# EAGLE design lec-buzzer_alt (EAGLE 8.4.0)
REVISION: v1.1; TEAM: Electrical Training
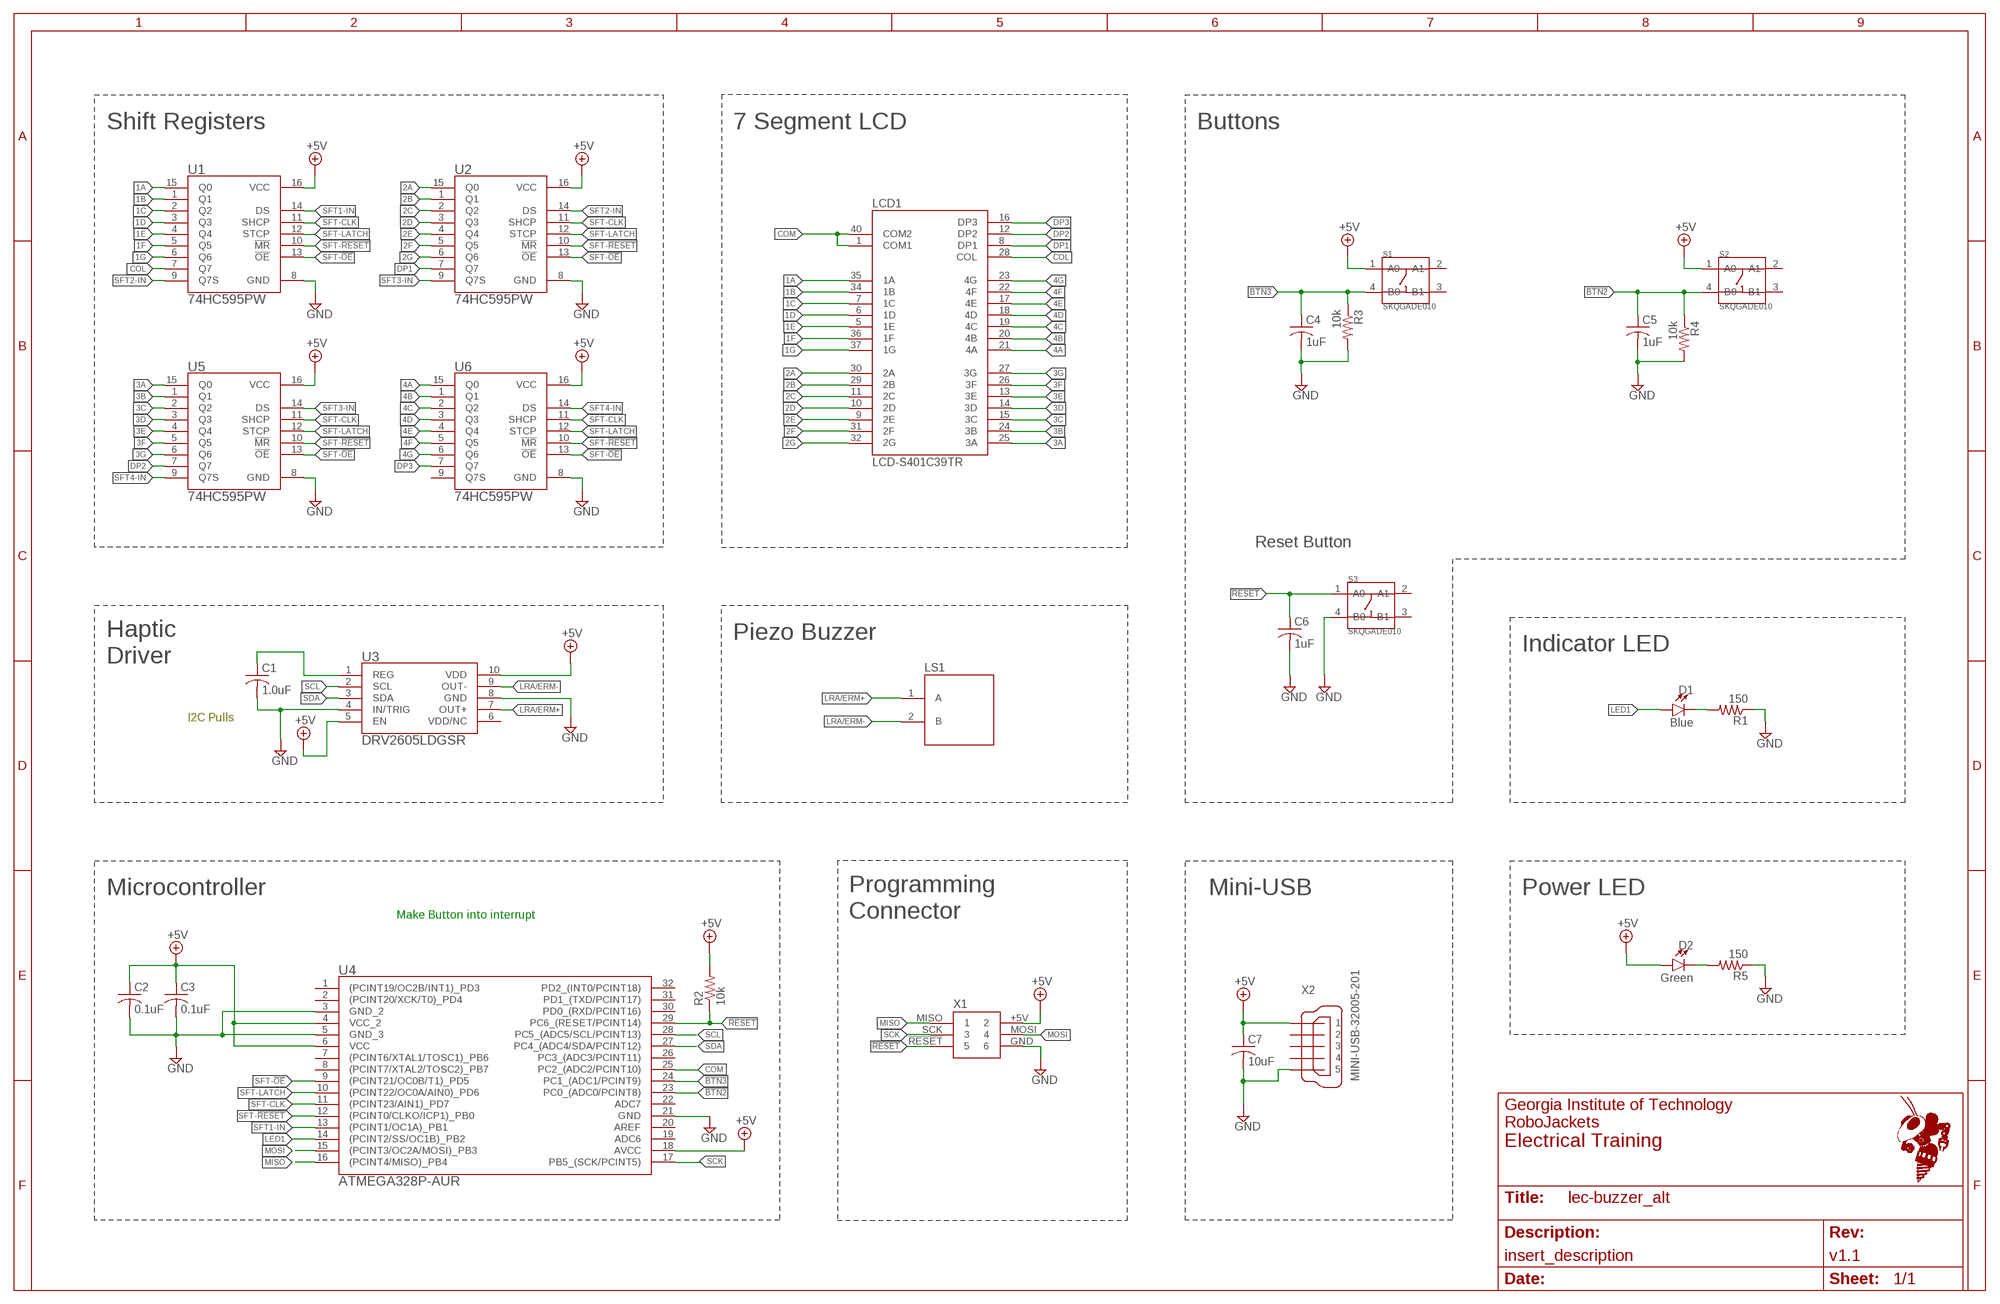
[diagram p0: schematic, sheet 1]
FRAME1 (FRAME_B_L): SCH_DESC: insert_description

## Parts
C1  1.0uF  C-USC0603  [C0603]
C2  0.1uF  C-USC0603  [C0603]
C3  0.1uF  C-USC0603  [C0603]
C4  1uF  C-USC0603  [C0603]
C5  1uF  C-USC0603  [C0603]
C6  1uF  C-USC0603  [C0603]
C7  10uF  C-USC0603  [C0603]
D1  Blue  LED-YELLOW0603  [LED-0603]
D2  Green  LED-YELLOW0603  [LED-0603]
LCD1  LCD-S401C39TR  [S401C39TR]
LS1  PS1240P02BT  [PS1240P02BT]
R1  150  R-US_R0603  [R0603]
R2  10k  R-US_R0603  [R0603]
R3  10k  R-US_R0603  [R0603]
R4  10k  R-US_R0603  [R0603]
R5  150  R-US_R0603  [R0603]
S1  SKQGADE010  SMD-SWITCH-TOP-260GF(4P-D5.2MM)  [SW4-SMD-5.2X5.2X1.5MM]
S2  SKQGADE010  SMD-SWITCH-TOP-260GF(4P-D5.2MM)  [SW4-SMD-5.2X5.2X1.5MM]
S3  SKQGADE010  SMD-SWITCH-TOP-260GF(4P-D5.2MM)  [SW4-SMD-5.2X5.2X1.5MM]
U1  74HC595PW  [SOT403-1]
U2  74HC595PW  [SOT403-1]
U3  DRV2605LDGSR  [DGS10]
U4  ATMEGA328P-AUR  [ATMEGA328P-AUR]
U5  74HC595PW  [SOT403-1]
U6  74HC595PW  [SOT403-1]
X1  2X3SHROUDED  [2X3SHROUDED]
X2  MINI-USB-32005-201  [32005-201]

## Nets
1A: LCD1.35(1A) U1.15(Q0)
1B: LCD1.34(1B) U1.1(Q1)
1C: LCD1.7(1C) U1.2(Q2)
1D: LCD1.6(1D) U1.3(Q3)
1E: LCD1.5(1E) U1.4(Q4)
1F: LCD1.36(1F) U1.5(Q5)
1G: LCD1.37(1G) U1.6(Q6)
2A: LCD1.30(2A) U2.15(Q0)
2B: LCD1.29(2B) U2.1(Q1)
2C: LCD1.11(2C) U2.2(Q2)
2D: LCD1.10(2D) U2.3(Q3)
2E: LCD1.9(2E) U2.4(Q4)
2F: LCD1.31(2F) U2.5(Q5)
2G: LCD1.32(2G) U2.6(Q6)
3A: LCD1.25(3A) U5.15(Q0)
3B: LCD1.24(3B) U5.1(Q1)
3C: LCD1.15(3C) U5.2(Q2)
3D: LCD1.14(3D) U5.3(Q3)
3E: LCD1.13(3E) U5.4(Q4)
3F: LCD1.26(3F) U5.5(Q5)
3G: LCD1.27(3G) U5.6(Q6)
4A: LCD1.21(4A) U6.15(Q0)
4B: LCD1.20(4B) U6.1(Q1)
4C: LCD1.19(4C) U6.2(Q2)
4D: LCD1.18(4D) U6.3(Q3)
4E: LCD1.17(4E) U6.4(Q4)
4F: LCD1.22(4F) U6.5(Q5)
4G: LCD1.23(4G) U6.6(Q6)
!BTN2: C5.1 R4.1 S2.4(B0) U4.23(PC0_(ADC0/PCINT8))
!BTN3: C4.1 R3.1 S1.4(B0) U4.24(PC1_(ADC1/PCINT9))
!RESET: C6.1 R2.1 S3.1(A0) U4.29(PC6_(RESET/PCINT14)) X1.!RESET
+5V: C2.1 C3.1 C7.1 D2.A R2.2 S1.1(A0) S2.1(A0) U1.16(VCC) U2.16(VCC) U3.5(EN) U3.10(VDD) U4.4(VCC_2) U4.6(VCC) U4.18(AVCC) U5.16(VCC) U6.16(VCC) X1.+5V X2.1
COL: LCD1.28(COL) U1.7(Q7)
COM: LCD1.1(COM1) LCD1.40(COM2) U4.25(PC2_(ADC2/PCINT10))
DP1: LCD1.8(DP1) U2.7(Q7)
DP2: LCD1.12(DP2) U5.7(Q7)
DP3: LCD1.16(DP3) U6.7(Q7)
GND: C1.2 C2.2 C3.2 C4.2 C5.2 C6.2 C7.2 R1.1 R3.2 R4.2 R5.1 S3.4(B0) U1.8(GND) U2.8(GND) U3.4(IN/TRIG) U3.8(GND) U4.3(GND_2) U4.5(GND_3) U4.21(GND) U5.8(GND) U6.8(GND) X1.GND X2.5
LED1: D1.A U4.14((PCINT2/SS/OC1B)_PB2)
LRA/ERM+: LS1.1(A) U3.7(OUT+)
LRA/ERM-: LS1.2(B) U3.9(OUT-)
MISO: U4.16((PCINT4/MISO)_PB4) X1.MISO
MOSI: U4.15((PCINT3/OC2A/MOSI)_PB3) X1.MOSI
N$1: D1.C R1.2
N$2: D2.C R5.2
N$3: C1.1 U3.1(REG)
SCK: U4.17(PB5_(SCK/PCINT5)) X1.SCK
SCL: U3.2(SCL) U4.28(PC5_(ADC5/SCL/PCINT13))
SDA: U3.3(SDA) U4.27(PC4_(ADC4/SDA/PCINT12))
SFT1-IN: U1.14(DS) U4.13((PCINT1/OC1A)_PB1)
SFT2-IN: U1.9(Q7S) U2.14(DS)
SFT3-IN: U2.9(Q7S) U5.14(DS)
SFT4-IN: U5.9(Q7S) U6.14(DS)
SFT-!OE: U1.13(!OE) U2.13(!OE) U4.9((PCINT21/OC0B/T1)_PD5) U5.13(!OE) U6.13(!OE)
SFT-!RESET: U1.10(!MR) U2.10(!MR) U4.12((PCINT0/CLKO/ICP1)_PB0) U5.10(!MR) U6.10(!MR)
SFT-CLK: U1.11(SHCP) U2.11(SHCP) U4.11((PCINT23/AIN1)_PD7) U5.11(SHCP) U6.11(SHCP)
SFT-LATCH: U1.12(STCP) U2.12(STCP) U4.10((PCINT22/OC0A/AIN0)_PD6) U5.12(STCP) U6.12(STCP)
Unconnected: S1.2(A1) S1.3(B1) S2.2(A1) S2.3(B1) S3.2(A1) S3.3(B1) U3.6(VDD/NC) U4.1((PCINT19/OC2B/INT1)_PD3) U4.2((PCINT20/XCK/T0)_PD4) U4.7((PCINT6/XTAL1/TOSC1)_PB6) U4.8((PCINT7/XTAL2/TOSC2)_PB7) U4.19(ADC6) U4.20(AREF) U4.22(ADC7) U4.26(PC3_(ADC3/PCINT11)) U4.30(PD0_(RXD/PCINT16)) U4.31(PD1_(TXD/PCINT17)) U4.32(PD2_(INT0/PCINT18)) U6.9(Q7S) X2.2 X2.3 X2.4

## Notes on the sheet
- Shift Registers | 7 Segment LCD | Buttons
- Reset Button
- Piezo Buzzer
- Indicator LED
- Haptic
  Driver
- I2C Pulls
- Microcontroller | Mini-USB | Power LED
- Make Button into interrupt
- Programming
  Connector

## Library data of the parts
C1-C3 C7 = rcl:C-US: CAPACITOR, American symbol
C4-C6 = resistor:C-US: CAPACITOR, American symbol
D1 D2 = SparkFun-LED:LED-YELLOW: Yellow SMD LED Used in manufacturing several products at SparkFun. Packages: 0603 - SMD 0603 package[Product Link] <http://www.kingbrightusa.com/product.asp?catalog_name=LED&product_id=APT1608SYCK> 0603 -SMART - SMART SMD 0603 package (more efficient/more expensive) [Product Link] <http://www.osram-os.com/osram_os/en/products/product-catalog/led-light-emitting-diodes/smartled-0603/ly-l29k/index.jsp> LilyPad - SMD1206 package[Product Datasheet] <https://www.sparkfun.com/datasheets/DevTools/LilyPad/Q150YUS4.pdf> SparkFun Products: Blynk Board <https://www.sparkfun.com/products/13794> IOIO-OTG <https://www.sparkfun.com/products/13613> XBee Explorer Serial <https://www.sparkfun.com/products/13225>; PROD_ID: DIO-09003; VALUE: Yellow
LCD1 = lcd-buzzer:LCD-S401C39TR
LS1 = lcd-buzzer:PS1240P02BT
R1 R3-R5 = resistor:R-US_: RESISTOR, American symbol
R2 = rcl:R-US_: RESISTOR, American symbol
S1-S3 = rgb-led:SMD-SWITCH-TOP-260GF(4P-D5.2MM): 311020017; MPN: SKQGADE010
U1 U2 U5 U6 = lcd-buzzer:74HC595PW
U3 = lcd-buzzer:DRV2605LDGSR; MANUFACTURER_PART_NUMBER: DRV2605LDGSR; VENDOR: Texas Instruments
U4 = lcd-buzzer:ATMEGA328P-*
X1 = lcd-buzzer:2X3SHROUDED
X2 = con-cypressindustries:MINI-USB-: MINI USB-B Conector Source: www.cypressindustries.com; OC_FARNELL: unknown; OC_NEWARK: unknown

## Board
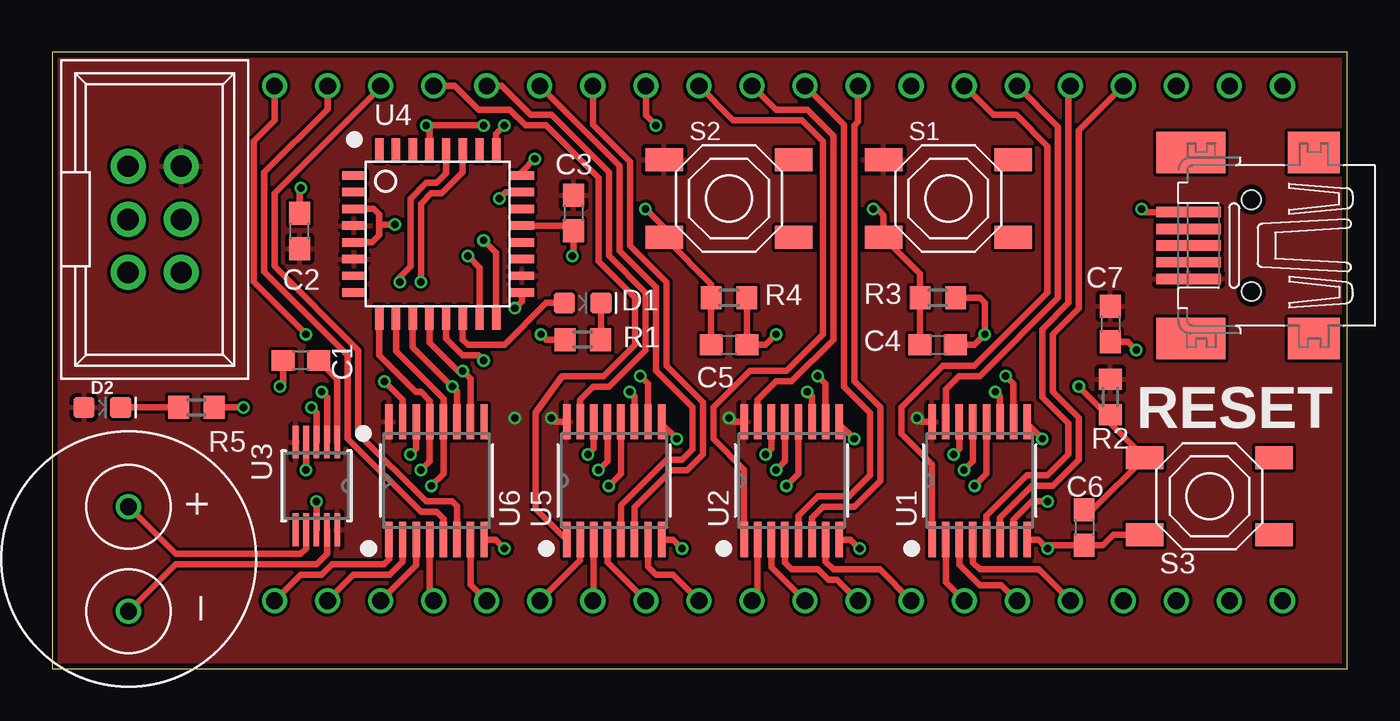
[diagram p1: board, top side]
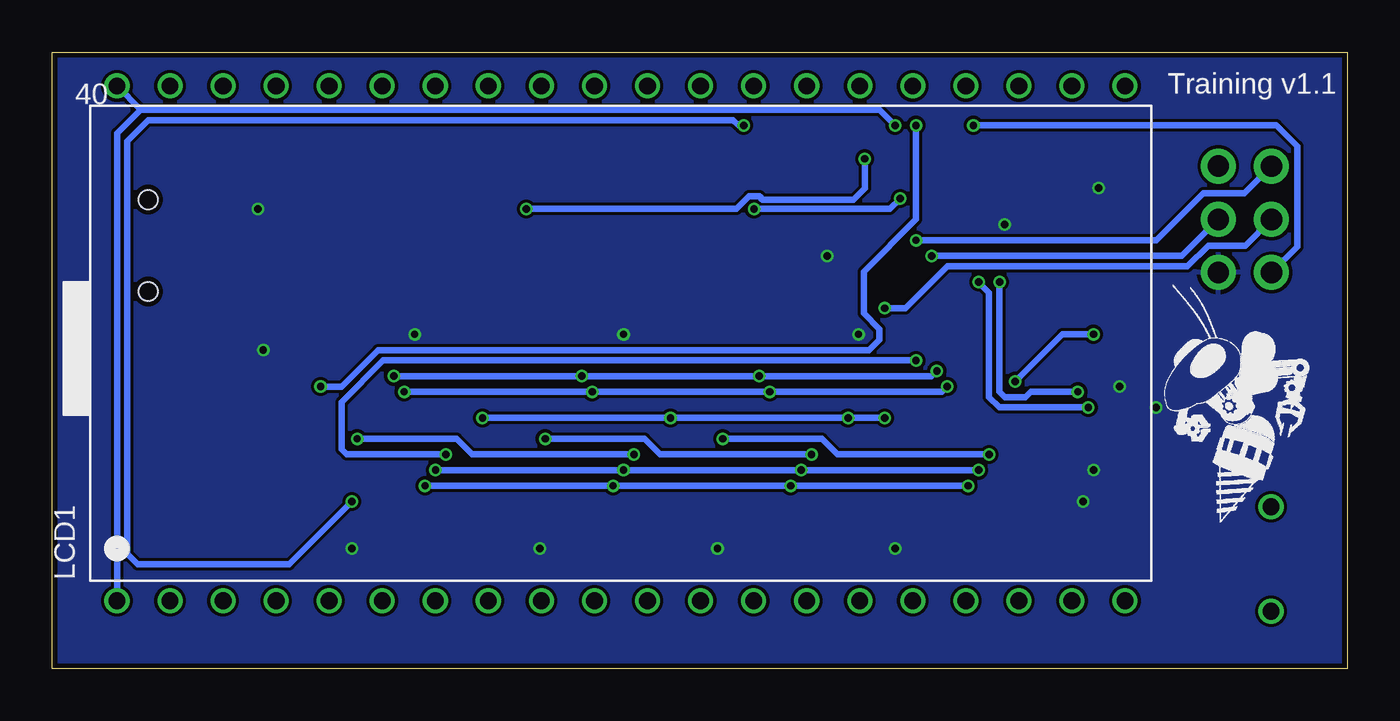
[diagram p2: board, bottom side, seen from below]

Size 62 x 29.5 mm. Coordinates in mm from the lower left corner, seen from the top.
Outline: 0,0 62,0 62,29.5 0,29.5 0,0
Copper layers (1*16): Top 0.018mm / dielectric 1.55mm / Bottom 0.018mm
Design rules "eC_2Layer_PClass6_BaseCopperO18_eCDefault *": minimum track width 0.15mm, minimum drill 0.35mm, track to track 0.15mm, track to pad 0.15mm, pad to pad 0.15mm, via to via 0.15mm, smd to smd 0mil, copper to edge 0.25mm, drill to drill 0.35mm, minimum pad ring 0.175mm, minimum via ring 0.125mm, stop-mask expansion 0mil, vias tented up to drill 0.45mm, thermal gap 0.2mm

### Footprints (pad centres in the part's own frame; a part is rotated, then mirrored left to right if it is on the bottom)
C0603 = smd 1.1 x 1: 1 -0.85,0; 2 0.85,0
LED-0603 = smd 1 x 1: A -0.877,0; C 0.877,0
S401C39TR = drill 0.8: 1 -24,-12.5; 2 -21.46,-12.5; 3 -18.92,-12.5; 4 -16.38,-12.5; 5 -13.84,-12.5; 6 -11.3,-12.5; 7 -8.76,-12.5; 8 -6.22,-12.5; 9 -3.68,-12.5; 10 -1.14,-12.5; 11 1.4,-12.5; 12 3.94,-12.5; 13 6.48,-12.5; 14 9.02,-12.5; 15 11.56,-12.5; 16 14.1,-12.5; 17 16.64,-12.5; 18 19.18,-12.5; 19 21.72,-12.5; 20 24.26,-12.5; 21 24.26,12.138; 22 21.72,12.138; 23 19.18,12.138; 24 16.64,12.138; 25 14.1,12.138; 26 11.56,12.138; 27 9.02,12.138; 28 6.48,12.138; 29 3.94,12.138; 30 1.4,12.138; 31 -1.14,12.138; 32 -3.68,12.138; 33 -6.22,12.138; 34 -8.76,12.138; 35 -11.3,12.138; 36 -13.84,12.138; 37 -16.38,12.138; 38 -18.92,12.138; 39 -21.46,12.138; 40 -24,12.138
PS1240P02BT = drill 0.8: 1 -2.5,0; 2 2.5,0
R0603 = smd 1 x 1.1: 1 -0.85,0; 2 0.85,0
SW4-SMD-5.2X5.2X1.5MM = smd 1.8 x 1.1: 1 -3.1,1.85; 2 3.1,1.85; 3 3.1,-1.85; 4 -3.1,-1.85
SOT403-1 = smd 1.676 x 0.356: 1 -2.819,2.275; 2 -2.819,1.625; 3 -2.819,0.975; 4 -2.819,0.325; 5 -2.819,-0.325; 6 -2.819,-0.975; 7 -2.819,-1.625; 8 -2.819,-2.275; 9 2.819,-2.275; 10 2.819,-1.625; 11 2.819,-0.975; 12 2.819,-0.325; 13 2.819,0.325; 14 2.819,0.975; 15 2.819,1.625; 16 2.819,2.275
DGS10 = smd 1.575 x 0.279: 1 -2.095,1; 2 -2.095,0.5; 3 -2.095,0; 4 -2.095,-0.5; 5 -2.095,-1; 6 2.095,-1; 7 2.095,-0.5; 8 2.095,0; 9 2.095,0.5; 10 2.095,1
ATMEGA328P-AUR = smd 1.15 x 0.4: 1 -3.946,2.603; 2 -3.955,1.803; 3 -3.955,1.003; 4 -3.955,0.203; 5 -3.955,-0.597; 6 -3.955,-1.397; 7 -3.955,-2.197; 8 -3.955,-2.997; 17 4.085,-2.997; 18 4.085,-2.197; 19 4.085,-1.397; 20 4.085,-0.597; 21 4.085,0.203; 22 4.085,1.003; 23 4.085,1.803; 24 4.085,2.603 | smd 0.4 x 1.15: 9 -2.743,-4.21; 10 -1.943,-4.21; 11 -1.143,-4.207; 12 -0.343,-4.21; 13 0.457,-4.21; 14 1.257,-4.207; 15 2.057,-4.207; 16 2.857,-4.207; 25 2.857,3.813; 26 2.057,3.813; 27 1.257,3.813; 28 0.457,3.811; 29 -0.343,3.811; 30 -1.143,3.813; 31 -1.943,3.811; 32 -2.743,3.811
2X3SHROUDED = drill 1.02 pad 1.676: !RESET -2.54,1.27; +5V 2.554,-1.27; GND -2.54,-1.27; MISO 2.54,1.27; MOSI 0,-1.27; SCK 0,1.27
32005-201 = smd 3.1 x 0.5: 1 3,1.6; 2 3,0.8; 3 3,0; 4 3,-0.8; 5 3,-1.6 | smd 2.5 x 2: M1 -3,-4.45; M2 -3,4.45 | smd 3.3 x 2: M3 2.9,4.45; M4 2.9,-4.45 | hole 0.9: 0,2.2; 0,-2.2

### Placement (x,y rotation side)
C1  11.9,14.75 180 top
C2  11.85,20.94 90 top
C3  24.95,21.81 270 top
C4  42.4,15.5 0 top
C5  32.4,15.5 0 top
C6  49.4,6.75 270 top
C7  50.65,16.5 270 top
D1  25.4,17.5 0 top
D2  2.4,12.5 0 top
LCD1  34.9,15.75 0 bottom
LS1  3.65,5.25 270 top
R1  25.4,15.75 0 top
R2  50.65,13 90 top
R3  42.4,17.75 0 top
R4  32.4,17.75 0 top
R5  6.9,12.5 180 top
S1  42.9,22.5 0 top
S2  32.4,22.5 0 top
S3  55.4,8.25 0 top
U1  44.4,9 90 top
U2  35.4,9 90 top
U3  12.65,8.75 270 top
U4  18.4,21 0 top
U5  26.9,9 90 top
U6  18.4,9 90 top
U$1  [ROBOBUZZ_0.6X]  6.1,7 0 bottom
X1  4.9,21.5 90 top
X2  57.4,20.25 180 top

### Tracks (layer width: path | path; a pad name or v marks a point on that pad's centre or on a via)
1A
  Top 0.3: U1.15 42.77,13.38 43.4,14 44.4,14 48.15,17.75 48.15,25.94 LCD1.35
1B
  Top 0.3: U1.1 42.12,9.78 40.65,11.25 40.65,12.5 42.65,14.5 44.15,14.5 47.65,18 47.65,25 46.15,26.5 45.05,26.5 LCD1.34
1C
  Top 0.3: U1.2 42.77,4.13 LCD1.7
1D
  Top 0.3: U1.3 43.42,4.97 44.4,4 45.45,4 LCD1.6
1E
  Top 0.3: U1.4 44.07,5.08 44.4,4.75 47.24,4.75 LCD1.5
1F
  Top 0.3: U1.5 44.73,7.33 46.65,9.25 47.65,9.25 48.65,10.25 48.65,11.75 47.4,13 47.4,16.25 48.65,17.5 48.65,27.8 LCD1.36
1G
  Top 0.3: U1.6 45.38,7.22 46.9,8.75 47.9,8.75 49.15,10 49.15,12 47.9,13.25 47.9,16 49.15,17.25 49.15,25.76 LCD1.37
2A
  Top 0.3: U2.15 33.77,12.88 34.65,13.75 35.4,13.75 37.4,15.75 37.4,25.5 36.15,26.75 34.64,26.75 LCD1.30
2B
  Top 0.3: U2.1 33.12,9.53 31.65,11 31.65,12.5 33.4,14.25 35.15,14.25 36.9,16 36.9,25.25 35.9,26.25 32.6,26.25 LCD1.29
2C
  Top 0.3: U2.2 33.77,3.52 LCD1.11
2D
  Top 0.3: U2.3 34.42,4.87 LCD1.10
2E
  Top 0.3: U2.4 35.07,5.08 35.4,4.75 36.65,4.75 37.15,4.25 37.58,4.25 LCD1.9
2F
  Top 0.3: U2.5 35.73,7.33 36.65,8.25 38.15,8.25 39.15,9.25 39.15,12.25 37.9,13.5 37.9,26.03 LCD1.31
2G
  Top 0.3: LCD1.32 38.58,26.18 38.4,26 38.4,13.75 39.65,12.5 39.65,9 38.4,7.75 36.9,7.75 36.38,7.22 U2.6
3A
  Top 0.3: LCD1.25 21.51,27.89 22.9,26.5 23.9,26.5 26.65,23.75 26.65,19.75 28.4,18 28.4,15.25 26.65,13.5 25.9,13.5 25.27,12.88 U5.15
3B
  Top 0.3: LCD1.24 19.26,27.89 20.4,26.75 21.9,26.75 22.65,26 23.65,26 26.15,23.5 26.15,19.5 27.9,17.75 27.9,15.5 26.4,14 24.4,14 23.15,12.25 23.15,7.66 U5.1
3C
  Top 0.3: U5.2 25.27,5.18 LCD1.15
3D
  Top 0.3: U5.3 25.92,3.29 LCD1.14
3E
  Top 0.3: U5.4 26.57,5.09 LCD1.13
3F
  Top 0.3: U5.5 27.22,7.83 29.4,10 30.15,10 30.65,10.5 30.65,12.5 28.9,14.25 28.9,18.25 27.15,20 27.15,24.08 LCD1.26
3G
  Top 0.3: LCD1.27 25.88,26.02 27.65,24.25 27.65,20.25 29.4,18.5 29.4,14.5 31.15,12.75 31.15,10.25 30.4,9.5 29.65,9.5 27.88,7.72 U5.6
4A  (via drill 0.35)
  Top 0.3: U6.15 16.77,12.88 v15.9,13.75 | v12.15,16 9.64,18.51 9.65,25.25 10.64,26.24 LCD1.21
  Bottom 0.3: v15.9,13.75 13.65,16 v12.15,16
4B
  Top 0.3: U6.1 16.12,5.22 15.9,5 13.4,5 12.9,4.5 11.89,4.5 LCD1.20
4C
  Top 0.3: LCD1.19 13.18,3.28 14.4,4.5 16.15,4.5 16.77,5.12 U6.2
4D
  Top 0.3: U6.3 17.42,4.96 LCD1.18
4E
  Top 0.3: U6.4 18.07,3.44 LCD1.17
4F
  Top 0.3: U6.5 18.72,7.17 18.4,7.5 17.65,7.5 14.15,11 14.15,15 10.15,19 10.15,23.75 13.18,26.78 LCD1.22
4G
  Top 0.3: U6.6 19.38,7.78 19.15,8 17.9,8 14.65,11.25 14.65,15.25 10.65,19.25 10.65,22.75 15.72,27.82 LCD1.23
!BTN2  (via drill 0.35)
  Top 0.3: C5.1 R4.1 31.55,18.4 29.42,20.52 | 29.42,20.52 S2.4 | U4.23 21.7,22.8 v21.4,22.5 | v28.4,22 29.42,20.98 29.42,20.52
  Bottom 0.3: v21.4,22.5 21.9,22 v28.4,22
!BTN3  (via drill 0.35)
  Top 0.3: C4.1 R3.1 41.55,18.9 S1.4 39.8,21.7 39.5,22 v39.3,22 | U4.24 22.48,23.79 v23.1,24.4
  Bottom 0.3: v23.1,24.4 23.1,23 23.65,22.45 28,22.45 28.15,22.6 28.65,22.6 29.25,22 v39.3,22
!RESET  (via drill 0.35)
  Top 0.3: C6.1 49.8,7.6 S3.1 50.65,11.75 R2.1 50.5,12.15 v49.15,13.5 | U4.29 18.06,25.84 v17.9,26 v20.65,26
  Bottom 0.3: v17.9,26 3.4,26 2.4,25 2.4,20.19 X1.!RESET | v49.15,13.5 48.15,13.5 46.4,15.25 22.9,15.25 22.4,15.75 22.4,16.25 23.15,17 23.15,19 20.65,21.5 v20.65,26
+5V  (via drill 0.35)
  Top 0.3: U1.16 41.58,11.82 v41.4,12 | U2.16 32.58,11.82 v32.4,12 | U5.16 24.08,11.82 v23.9,12
  Bottom 0.3: v41.4,12 v32.4,12 v23.9,12 v22.15,12
  pour Top: 0.13,29.43 61.92,29.43 61.92,-0.01 0.13,-0.01
COL  (via drill 0.35)
  Top 0.3: LCD1.28 28.42,26.48 v28.9,26 | U1.7 46.02,7.12 46.9,8 v47.65,8
  Bottom 0.3: v28.9,26 29.15,26 29.4,26.25 57.4,26.25 58.4,25.25 58.4,5.5 57.9,5 50.65,5 v47.65,8
COM  (via drill 0.35)
  Top 0.3: U4.25 21.26,25.61 v21.65,26
  Bottom 0.3: 57.76,26.75 LCD1.40 | LCD1.1 58.9,25.61 57.76,26.75 | v21.65,26 22.4,26.75 57.76,26.75
DP1
  Top 0.3: U2.7 37.02,5.12 37.4,4.75 39.62,4.75 LCD1.8
DP2
  Top 0.3: U5.7 28.52,4.88 28.9,4.5 29.71,4.5 LCD1.12
DP3
  Top 0.3: U6.7 20.02,4.03 LCD1.16
GND  (via drill 0.35)
  Top 0.3: U4.5 15.3,20.4 15.65,20.75 15.65,21.25 | U4.3 15.4,22 15.65,21.75 15.65,21.25 | v16.4,21.25 15.65,21.25 | U6.8 21.22,6.18 v21.65,5.75 | U5.8 29.72,6.18 v30.15,5.75 | U2.8 38.22,6.18 v38.65,5.75 | U1.8 47.22,6.18 v47.65,5.75 47.8,5.9 C6.2 50.3,5.9 50.8,6.4 S3.4 | R4.2 C5.2 34.15,15.5 v34.65,16 | C4.2 44.15,15.5 v44.65,16 44.65,17.5 44.4,17.75 R3.2 | X2.5 52.3,21.85 v52.15,22 | v12.15,9.5 U3.4 | C1.2 11.05,13.65 v10.9,13.5 | R5.1 v9.15,12.5 | C2.2 11.85,22.95 v11.9,23 | C7.2 51.5,15.65 v51.9,15.25 | U4.21 24.71,21.2 C3.2 24.95,19.8 v24.9,19.75 | U3.8 v12.65,8 | R1.1 23.65,15.75 v23.4,16
  pour Bottom: 0.13,29.43 61.92,29.43 61.92,-0.01 0.13,-0.01
LED1
  Top 0.3: U4.14 19.66,15.74 19.9,15.5 21.65,15.5 23.65,17.5 D1.A
LRA/ERM+
  Top 0.3: U3.7 12.15,5.75 11.9,5.5 5.9,5.5 LS1.1
LRA/ERM-
  Top 0.3: U3.9 13.15,5.5 12.65,5 5.9,5 LS1.2
MISO  (via drill 0.35)
  Top 0.3: U4.16 21.26,19.89 v20.65,20.5
  Bottom 0.3: v20.65,20.5 9.15,20.5 6.9,22.75 4.92,22.75 X1.MISO
MOSI  (via drill 0.35)
  Top 0.3: U4.15 20.46,19.19 v19.9,19.75
  Bottom 0.3: v19.9,19.75 7.92,19.75 X1.MOSI
N$1
  Top 0.3: D1.C 26.28,15.78 R1.2
N$2
  Top 0.3: R5.2 D2.C
N$3
  Top 0.3: U3.1 13.65,13.85 C1.1
SCK  (via drill 0.35)
  Top 0.3: U4.17 22.48,17.58 v22.15,17.25
  Bottom 0.3: 8.65,19.25 8.9,19.25 | 8.9,19.25 19.15,19.25 21.15,17.25 v22.15,17.25 | 8.9,19.25 7.65,19.25 6.65,20.25 4.88,20.25 X1.SCK
SCL  (via drill 0.35)
  Top 0.3: U4.28 18.86,23.71 18.4,23.25 17.9,23.25 17.15,22.5 17.15,19.25 16.65,18.75 v16.65,18.5 | U3.2 13.15,13 v12.9,13.25
  Bottom 0.3: v12.9,13.25 15.15,13.25 15.4,13 16.4,13 16.65,13.25 v16.65,18.5
SDA  (via drill 0.35)
  Top 0.3: U4.27 19.66,23.76 18.65,22.75 18.15,22.75 17.65,22.25 v17.65,18.5 | U3.3 12.65,12.25 v12.4,12.5
  Bottom 0.3: v12.4,12.5 16.65,12.5 17.15,13 17.15,18 v17.65,18.5
SFT1-IN  (via drill 0.35)
  Top 0.3: U4.13 18.86,15.79 19.65,15 20.4,15 v20.65,14.75 | U1.14 43.42,10.53 v43.15,10.25
  Bottom 0.3: v43.15,10.25 47.9,10.25 48.15,10.5 48.15,12.75 46.15,14.75 v20.65,14.75
SFT2-IN  (via drill 0.35)
  Top 0.3: U2.14 34.42,10.53 v34.15,10.25 | U1.9 46.67,11.72 v47.4,11
  Bottom 0.3: v34.15,10.25 41.9,10.25 42.65,11 v47.4,11
SFT3-IN  (via drill 0.35)
  Top 0.3: U2.9 37.67,11.72 v38.4,11 | U5.14 25.92,10.53 v25.65,10.25
  Bottom 0.3: v38.4,11 33.65,11 32.9,10.25 v25.65,10.25
SFT4-IN  (via drill 0.35)
  Top 0.3: U6.14 17.42,10.53 v17.15,10.25 | U5.9 29.17,11.72 v29.9,11
  Bottom 0.3: v29.9,11 25.15,11 24.4,10.25 v17.15,10.25
SFT-!OE  (via drill 0.35)
  Top 0.3: U1.13 44.07,9.93 v43.65,9.5 | U2.13 35.07,9.93 v34.65,9.5 | U5.13 26.57,9.93 v26.15,9.5 | v17.65,9.5 18.07,9.93 U6.13 18.07,12.82 17.65,13.25 17.4,13.25 15.65,15 15.66,15.26 U4.9
  Bottom 0.3: v43.65,9.5 v34.65,9.5 v26.15,9.5 v17.65,9.5
SFT-!RESET  (via drill 0.35)
  Top 0.3: U1.10 46.02,13.62 v45.65,14 | U2.10 37.02,13.62 v36.65,14 | U5.10 28.52,13.62 v28.15,14 | U6.10 20.02,13.88 v19.65,14.25 19.4,14.25 18.06,15.59 U4.12
  Bottom 0.3: v45.65,14 v36.65,14 v28.15,14 19.9,14 v19.65,14.25
SFT-CLK  (via drill 0.35)
  Top 0.3: U1.11 45.38,13.03 v45.15,13.25 | U2.11 36.38,13.03 v36.15,13.25 | U5.11 27.88,13.03 v27.65,13.25 | U6.11 19.38,13.28 v19.15,13.5 17.26,15.39 U4.11
  Bottom 0.3: v45.15,13.25 v36.15,13.25 v27.65,13.25 19.4,13.25 v19.15,13.5
SFT-LATCH  (via drill 0.35)
  Top 0.3: U1.12 44.73,9.32 v44.15,8.75 | U2.12 35.73,9.32 v35.15,8.75 | U5.12 27.22,9.32 v26.65,8.75 | v18.15,8.75 18.72,9.32 U6.12 18.72,12.93 16.46,15.19 U4.10
  Bottom 0.3: v44.15,8.75 v35.15,8.75 v26.65,8.75 v18.15,8.75

### Text on the board
tPlace: RESET
bPlace: Training v1.1
bNames: 40